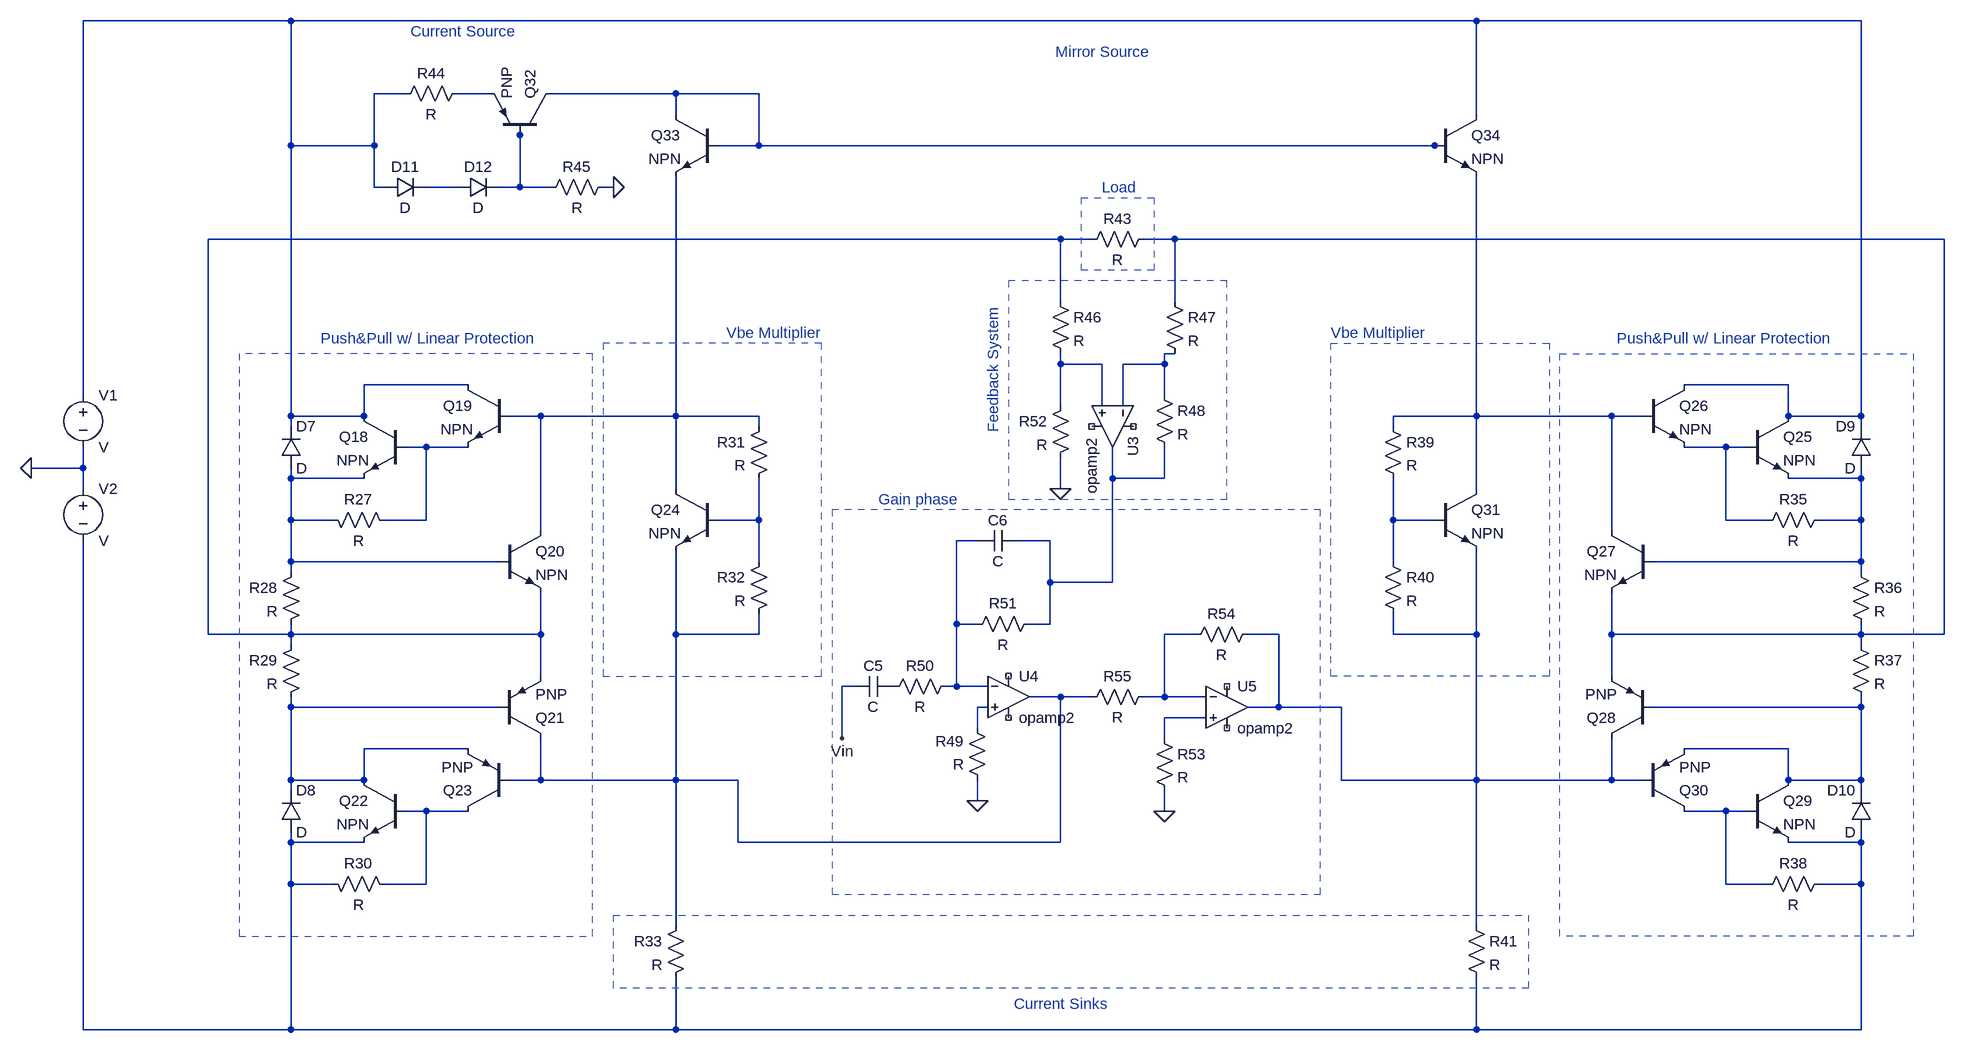
[diagram p0: schematic V1.asc]
V1.asc, the LTspice schematic file:
Version 4
SHEET 1 7252 2148
WIRE 2672 -512 2352 -512
WIRE 4496 -512 2672 -512
WIRE 5088 -512 4496 -512
WIRE 2848 -400 2800 -400
WIRE 2976 -400 2928 -400
WIRE 3264 -400 3072 -400
WIRE 3392 -400 3264 -400
WIRE 3264 -368 3264 -400
WIRE 4496 -368 4496 -512
WIRE 3024 -336 3024 -352
WIRE 2672 -320 2672 -512
WIRE 2800 -320 2800 -400
WIRE 2800 -320 2672 -320
WIRE 3392 -320 3392 -400
WIRE 3392 -320 3328 -320
WIRE 4432 -320 3392 -320
WIRE 4448 -320 4432 -320
WIRE 2800 -256 2800 -320
WIRE 2816 -256 2800 -256
WIRE 2928 -256 2880 -256
WIRE 3024 -256 3024 -336
WIRE 3024 -256 2992 -256
WIRE 3072 -256 3024 -256
WIRE 3168 -256 3152 -256
WIRE 3856 -176 2544 -176
WIRE 3904 -176 3856 -176
WIRE 4032 -176 3984 -176
WIRE 5216 -176 4032 -176
WIRE 3856 -80 3856 -176
WIRE 4032 -80 4032 -176
WIRE 4032 0 4016 0
WIRE 3856 16 3856 0
WIRE 3920 16 3856 16
WIRE 4016 16 4016 0
WIRE 4016 16 3952 16
WIRE 2944 48 2784 48
WIRE 4976 48 4816 48
WIRE 2352 64 2352 -512
WIRE 4016 64 4016 16
WIRE 3856 80 3856 16
WIRE 3920 80 3920 16
WIRE 3952 80 3952 16
WIRE 2672 96 2672 -320
WIRE 2784 96 2784 48
WIRE 2784 96 2672 96
WIRE 3056 96 3008 96
WIRE 3264 96 3264 -272
WIRE 3264 96 3056 96
WIRE 3392 96 3264 96
WIRE 4496 96 4496 -272
WIRE 4496 96 4368 96
WIRE 4704 96 4496 96
WIRE 4752 96 4704 96
WIRE 4976 96 4976 48
WIRE 5088 96 5088 -512
WIRE 5088 96 4976 96
WIRE 2672 112 2672 96
WIRE 3392 112 3392 96
WIRE 4368 112 4368 96
WIRE 5088 112 5088 96
WIRE 2880 144 2848 144
WIRE 2944 144 2880 144
WIRE 4880 144 4816 144
WIRE 4912 144 4880 144
WIRE 2352 176 2352 144
WIRE 2352 176 2272 176
WIRE 2672 192 2672 176
WIRE 2784 192 2672 192
WIRE 3936 192 3936 144
WIRE 4016 192 4016 144
WIRE 4016 192 3936 192
WIRE 5088 192 5088 176
WIRE 5088 192 4976 192
WIRE 2352 208 2352 176
WIRE 3264 208 3264 96
WIRE 3856 208 3856 160
WIRE 4496 208 4496 96
WIRE 2672 256 2672 192
WIRE 2736 256 2672 256
WIRE 2880 256 2880 144
WIRE 2880 256 2816 256
WIRE 3392 256 3392 192
WIRE 3392 256 3328 256
WIRE 4368 256 4368 192
WIRE 4432 256 4368 256
WIRE 4880 256 4880 144
WIRE 4944 256 4880 256
WIRE 5088 256 5088 192
WIRE 5088 256 5024 256
WIRE 3056 272 3056 96
WIRE 4704 272 4704 96
WIRE 3728 288 3696 288
WIRE 3840 288 3792 288
WIRE 2672 320 2672 256
WIRE 2992 320 2672 320
WIRE 3392 320 3392 256
WIRE 4368 320 4368 256
WIRE 5088 320 5088 256
WIRE 5088 320 4768 320
WIRE 2672 336 2672 320
WIRE 5088 336 5088 320
WIRE 3840 352 3840 288
WIRE 3936 352 3936 192
WIRE 3936 352 3840 352
WIRE 3696 416 3696 288
WIRE 3728 416 3696 416
WIRE 3840 416 3840 352
WIRE 3840 416 3808 416
WIRE 2544 432 2544 -176
WIRE 2672 432 2672 416
WIRE 2672 432 2544 432
WIRE 3056 432 3056 368
WIRE 3056 432 2672 432
WIRE 3264 432 3264 304
WIRE 3392 432 3392 400
WIRE 3392 432 3264 432
WIRE 4064 432 4016 432
WIRE 4192 432 4144 432
WIRE 4368 432 4368 400
WIRE 4496 432 4496 304
WIRE 4496 432 4368 432
WIRE 4704 432 4704 368
WIRE 5088 432 5088 416
WIRE 5088 432 4704 432
WIRE 5216 432 5216 -176
WIRE 5216 432 5088 432
WIRE 2672 448 2672 432
WIRE 5088 448 5088 432
WIRE 3056 496 3056 432
WIRE 4704 496 4704 432
WIRE 3536 512 3520 512
WIRE 3696 512 3696 416
WIRE 3696 512 3680 512
WIRE 3744 512 3696 512
WIRE 3856 528 3808 528
WIRE 3904 528 3856 528
WIRE 4016 528 4016 432
WIRE 4016 528 3984 528
WIRE 4080 528 4016 528
WIRE 2672 544 2672 528
WIRE 2992 544 2672 544
WIRE 3744 544 3728 544
WIRE 4192 544 4192 432
WIRE 4192 544 4144 544
WIRE 4288 544 4192 544
WIRE 5088 544 5088 528
WIRE 5088 544 4768 544
WIRE 4080 560 4016 560
WIRE 3728 576 3728 544
WIRE 3520 592 3520 512
WIRE 4016 592 4016 560
WIRE 2944 608 2784 608
WIRE 4976 608 4816 608
WIRE 2672 656 2672 544
WIRE 2784 656 2784 608
WIRE 2784 656 2672 656
WIRE 3056 656 3056 592
WIRE 3056 656 3008 656
WIRE 3264 656 3264 432
WIRE 3264 656 3056 656
WIRE 3360 656 3264 656
WIRE 4288 656 4288 544
WIRE 4496 656 4496 432
WIRE 4496 656 4288 656
WIRE 4704 656 4704 592
WIRE 4704 656 4496 656
WIRE 4752 656 4704 656
WIRE 4976 656 4976 608
WIRE 5088 656 5088 544
WIRE 5088 656 4976 656
WIRE 2672 672 2672 656
WIRE 5088 672 5088 656
WIRE 3728 688 3728 656
WIRE 2880 704 2848 704
WIRE 2944 704 2880 704
WIRE 4016 704 4016 672
WIRE 4880 704 4816 704
WIRE 4912 704 4880 704
WIRE 2672 752 2672 736
WIRE 2784 752 2672 752
WIRE 3360 752 3360 656
WIRE 3856 752 3856 528
WIRE 3856 752 3360 752
WIRE 5088 752 5088 736
WIRE 5088 752 4976 752
WIRE 2672 816 2672 752
WIRE 2736 816 2672 816
WIRE 2880 816 2880 704
WIRE 2880 816 2816 816
WIRE 4880 816 4880 704
WIRE 4944 816 4880 816
WIRE 5088 816 5088 752
WIRE 5088 816 5024 816
WIRE 3264 880 3264 656
WIRE 4496 880 4496 656
WIRE 2352 1040 2352 288
WIRE 2672 1040 2672 816
WIRE 2672 1040 2352 1040
WIRE 3264 1040 3264 960
WIRE 3264 1040 2672 1040
WIRE 4496 1040 4496 960
WIRE 4496 1040 3264 1040
WIRE 5088 1040 5088 816
WIRE 5088 1040 4496 1040
FLAG 3168 -256 0
FLAG 3728 688 0
FLAG 3520 592 Vin
FLAG 3856 208 0
FLAG 4016 704 0
FLAG 2272 176 0
SYMBOL npn 2848 96 M0
SYMATTR InstName Q18
SYMBOL npn 3008 48 M0
SYMATTR InstName Q19
SYMBOL diode 2656 176 M180
WINDOW 0 24 64 Left 2
WINDOW 3 24 0 Left 2
SYMATTR InstName D7
SYMBOL res 2720 240 M90
WINDOW 0 0 56 VBottom 2
WINDOW 3 32 56 VTop 2
SYMATTR InstName R27
SYMBOL npn 2992 272 R0
SYMATTR InstName Q20
SYMBOL res 2688 320 M0
SYMATTR InstName R28
SYMBOL res 2688 432 M0
SYMATTR InstName R29
SYMBOL pnp 2992 592 M180
SYMATTR InstName Q21
SYMBOL npn 2848 656 M0
SYMATTR InstName Q22
SYMBOL diode 2656 736 M180
WINDOW 0 24 64 Left 2
WINDOW 3 24 0 Left 2
SYMATTR InstName D8
SYMBOL res 2720 800 M90
WINDOW 0 0 56 VBottom 2
WINDOW 3 32 56 VTop 2
SYMATTR InstName R30
SYMBOL pnp 3008 704 R180
SYMATTR InstName Q23
SYMBOL npn 3328 208 M0
SYMATTR InstName Q24
SYMBOL res 3408 96 M0
SYMATTR InstName R31
SYMBOL res 3408 304 M0
SYMATTR InstName R32
SYMBOL res 3280 864 M0
SYMATTR InstName R33
SYMBOL npn 4912 96 R0
SYMATTR InstName Q25
SYMBOL npn 4752 48 R0
SYMATTR InstName Q26
SYMBOL diode 5104 176 R180
WINDOW 0 24 64 Left 2
WINDOW 3 24 0 Left 2
SYMATTR InstName D9
SYMBOL res 5040 240 R90
WINDOW 0 0 56 VBottom 2
WINDOW 3 32 56 VTop 2
SYMATTR InstName R35
SYMBOL npn 4768 272 M0
SYMATTR InstName Q27
SYMBOL res 5072 320 R0
SYMATTR InstName R36
SYMBOL res 5072 432 R0
SYMATTR InstName R37
SYMBOL pnp 4768 592 R180
SYMATTR InstName Q28
SYMBOL npn 4912 656 R0
SYMATTR InstName Q29
SYMBOL diode 5104 736 R180
WINDOW 0 24 64 Left 2
WINDOW 3 24 0 Left 2
SYMATTR InstName D10
SYMBOL res 5040 800 R90
WINDOW 0 0 56 VBottom 2
WINDOW 3 32 56 VTop 2
SYMATTR InstName R38
SYMBOL pnp 4752 704 M180
SYMATTR InstName Q30
SYMBOL npn 4432 208 R0
SYMATTR InstName Q31
SYMBOL res 4352 96 R0
SYMATTR InstName R39
SYMBOL res 4352 304 R0
SYMATTR InstName R40
SYMBOL res 4480 864 R0
SYMATTR InstName R41
SYMBOL res 4000 -192 R90
WINDOW 0 0 56 VBottom 2
WINDOW 3 32 56 VTop 2
SYMATTR InstName R43
SYMBOL pnp 3072 -336 M270
SYMATTR InstName Q32
SYMBOL res 2832 -384 R270
WINDOW 0 32 56 VTop 2
WINDOW 3 0 56 VBottom 2
SYMATTR InstName R44
SYMBOL res 3056 -240 R270
WINDOW 0 32 56 VTop 2
WINDOW 3 0 56 VBottom 2
SYMATTR InstName R45
SYMBOL diode 2816 -240 R270
WINDOW 0 32 32 VTop 2
WINDOW 3 0 32 VBottom 2
SYMATTR InstName D11
SYMBOL diode 2928 -240 R270
WINDOW 0 32 32 VTop 2
WINDOW 3 0 32 VBottom 2
SYMATTR InstName D12
SYMBOL npn 3328 -368 M0
SYMATTR InstName Q33
SYMBOL npn 4432 -368 R0
SYMATTR InstName Q34
SYMBOL Opamps\\opamp2 3776 464 R0
SYMATTR InstName U4
SYMBOL res 3744 672 R180
WINDOW 0 36 76 Left 2
WINDOW 3 36 40 Left 2
SYMATTR InstName R49
SYMBOL res 3696 496 R90
WINDOW 0 0 56 VBottom 2
WINDOW 3 32 56 VTop 2
SYMATTR InstName R50
SYMBOL cap 3600 496 R90
WINDOW 0 0 32 VBottom 2
WINDOW 3 32 32 VTop 2
SYMATTR InstName C5
SYMBOL res 3824 400 R90
WINDOW 0 0 56 VBottom 2
WINDOW 3 32 56 VTop 2
SYMATTR InstName R51
SYMBOL cap 3792 272 R90
WINDOW 0 0 32 VBottom 2
WINDOW 3 32 32 VTop 2
SYMATTR InstName C6
SYMBOL Opamps\\opamp2 4000 112 R90
SYMATTR InstName U3
SYMBOL res 3840 -96 R0
SYMATTR InstName R46
SYMBOL res 4016 -96 R0
SYMATTR InstName R47
SYMBOL res 4000 48 R0
SYMATTR InstName R48
SYMBOL res 3872 64 M0
SYMATTR InstName R52
SYMBOL Opamps\\opamp2 4112 480 R0
SYMATTR InstName U5
SYMBOL res 4000 576 R0
SYMATTR InstName R53
SYMBOL res 4160 416 R90
WINDOW 0 0 56 VBottom 2
WINDOW 3 32 56 VTop 2
SYMATTR InstName R54
SYMBOL res 4000 512 R90
WINDOW 0 0 56 VBottom 2
WINDOW 3 32 56 VTop 2
SYMATTR InstName R55
SYMBOL voltage 2352 48 R0
SYMATTR InstName V1
SYMBOL voltage 2352 192 R0
SYMATTR InstName V2
TEXT 3048 -24 Right 2 ;Push&Pull w/ Linear Protection
TEXT 3488 -32 Right 2 ;Vbe Multiplier
TEXT 4712 -24 Left 2 ;Push&Pull w/ Linear Protection
TEXT 4272 -32 Left 2 ;Vbe Multiplier
TEXT 3576 224 Left 2 ;Gain phase
TEXT 3752 -72 VRight 2 ;Feedback System
TEXT 3920 -256 Left 2 ;Load
TEXT 2856 -496 Left 2 ;Current Source
TEXT 3848 -464 Left 2 ;Mirror Source
TEXT 3784 1000 Left 2 ;Current Sinks
RECTANGLE Normal 3152 496 3488 -16 2
RECTANGLE Normal 2592 896 3136 0 2
RECTANGLE Normal 4608 496 4272 -16 2
RECTANGLE Normal 5168 896 4624 0 2
RECTANGLE Normal 4256 240 3504 832 2
RECTANGLE Normal 4112 -112 3776 224 2
RECTANGLE Normal 4000 -128 3888 -240 2
RECTANGLE Normal 4576 976 3168 864 2

The netlist it stands for:
* V1.asc
Q18 N001 N012 N014 0 NPN
Q19 N001 N010 N012 0 NPN
D7 N014 N001 D
R27 N014 N012 R
Q20 N010 N014 N006 0 NPN
R28 N014 N006 R
R29 N006 N023 R
Q21 N020 N023 N006 0 PNP
Q22 N023 N027 N029 0 NPN
D8 N029 N023 D
R30 N029 N027 R
Q23 N027 N020 N023 0 PNP
Q24 N010 N017 N020 0 NPN
R31 N010 N017 R
R32 N017 N020 R
R33 N020 N029 R
Q25 N001 N013 N016 0 NPN
Q26 N001 N011 N013 0 NPN
D9 N016 N001 D
R35 N016 N013 R
Q27 N011 N016 N007 0 NPN
R36 N016 N007 R
R37 N007 N025 R
Q28 N022 N025 N007 0 PNP
Q29 N025 N028 N029 0 NPN
D10 N029 N025 D
R38 N029 N028 R
Q30 N028 N022 N025 0 PNP
Q31 N011 N018 N022 0 NPN
R39 N011 N018 R
R40 N018 N022 R
R41 N022 N029 R
R43 N007 N006 R
Q32 N003 N004 N002 0 PNP
R44 N001 N002 R
R45 N004 0 R
D11 N001 N005 D
D12 N005 N004 D
Q33 N003 N003 N010 0 NPN
Q34 N001 N003 N011 0 NPN
XU4 N024 N019 NC_01 NC_02 N020 opamp2  ; pins In+ In- V+ V- OUT
R49 0 N024 R
R50 N019 P001 R
C5 P001 Vin C
R51 N015 N019 R
C6 N015 N019 C
XU3 N009 N008 NC_03 NC_04 N015 opamp2  ; pins In+ In- V+ V- OUT
R46 N006 N009 R
R47 N007 N008 R
R48 N008 N015 R
R52 N009 0 R
XU5 N026 N021 NC_05 NC_06 N022 opamp2  ; pins In+ In- V+ V- OUT
R53 N026 0 R
R54 N022 N021 R
R55 N021 N020 R
V1 N001 0 V
V2 0 N029 V
.model D D
.lib standard.dio
.model NPN NPN
.model PNP PNP
.lib standard.bjt
* Push&Pull w/ Linear Protection
* Vbe Multiplier
* Push&Pull w/ Linear Protection
* Vbe Multiplier
* Gain phase
* Feedback System
* Load
* Current Source
* Mirror Source
* Current Sinks
.backanno
.end